# Altium schematic sheet DE-270124.SchDoc: RELAY BOARD
size A4; Author: eldar6776@hotmail.com; DrawnBy: Eldar Dedić; Organization: JUBERA d.o.o.; Address1: Braće Mulić 81; Address2: 71000 Sarajevo; Address3: Federacija BiH; Address4: Bosna i Hercegovina; DocumentNumber: 1; Revision: 001; SheetNumber: 1; SheetTotal: 1; ProjectName: DE'270124
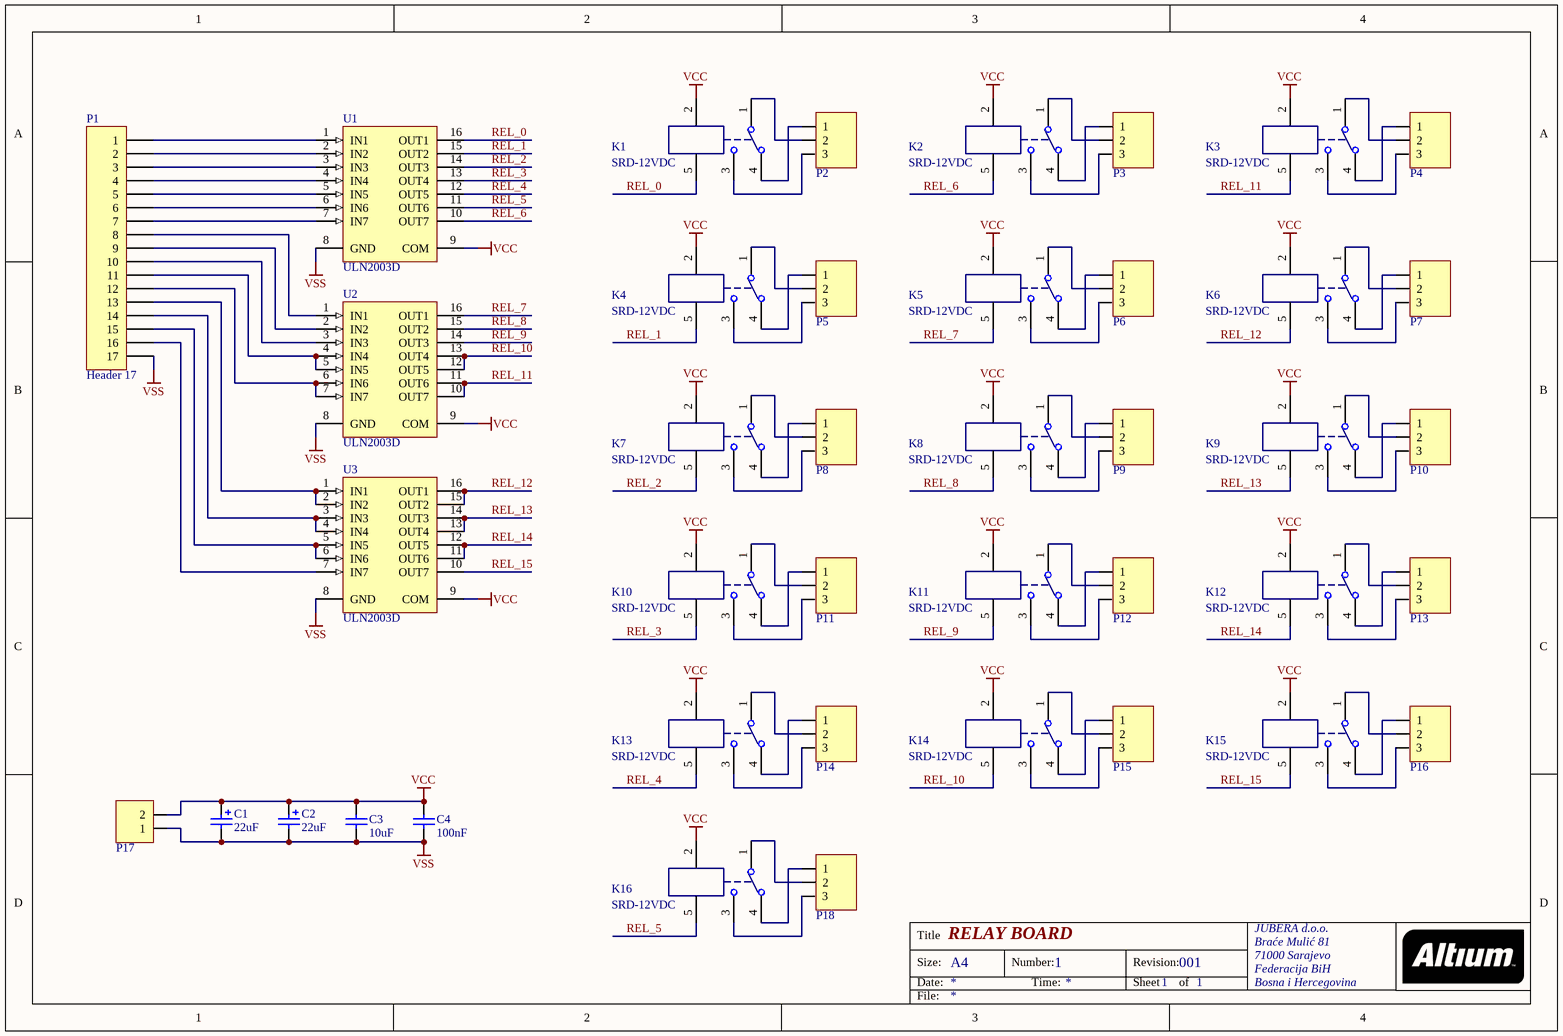
[diagram p0: DE-270124.SchDoc]

## Parts
C1  22uF  [CAPPR2-5X11]
C2  22uF  [CAPPR2-5X11]
C3  10uF  [0805]
C4  100nF  [0603]
K1  SRD-12VDC  [SRD-12VDC-SL-O]
K2  SRD-12VDC  [SRD-12VDC-SL-O]
K3  SRD-12VDC  [SRD-12VDC-SL-O]
K4  SRD-12VDC  [SRD-12VDC-SL-O]
K5  SRD-12VDC  [SRD-12VDC-SL-O]
K6  SRD-12VDC  [SRD-12VDC-SL-O]
K7  SRD-12VDC  [SRD-12VDC-SL-O]
K8  SRD-12VDC  [SRD-12VDC-SL-O]
K9  SRD-12VDC  [SRD-12VDC-SL-O]
K10  SRD-12VDC  [SRD-12VDC-SL-O]
K11  SRD-12VDC  [SRD-12VDC-SL-O]
K12  SRD-12VDC  [SRD-12VDC-SL-O]
K13  SRD-12VDC  [SRD-12VDC-SL-O]
K14  SRD-12VDC  [SRD-12VDC-SL-O]
K15  SRD-12VDC  [SRD-12VDC-SL-O]
K16  SRD-12VDC  [SRD-12VDC-SL-O]
P1  Header 17  [HDR1X17]
P2  TERMINAL BLOK 3  [TERMINAL BLOK 3]  (value not drawn)
P3  TERMINAL BLOK 3  [TERMINAL BLOK 3]  (value not drawn)
P4  TERMINAL BLOK 3  [TERMINAL BLOK 3]  (value not drawn)
P5  TERMINAL BLOK 3  [TERMINAL BLOK 3]  (value not drawn)
P6  TERMINAL BLOK 3  [TERMINAL BLOK 3]  (value not drawn)
P7  TERMINAL BLOK 3  [TERMINAL BLOK 3]  (value not drawn)
P8  TERMINAL BLOK 3  [TERMINAL BLOK 3]  (value not drawn)
P9  TERMINAL BLOK 3  [TERMINAL BLOK 3]  (value not drawn)
P10  TERMINAL BLOK 3  [TERMINAL BLOK 3]  (value not drawn)
P11  TERMINAL BLOK 3  [TERMINAL BLOK 3]  (value not drawn)
P12  TERMINAL BLOK 3  [TERMINAL BLOK 3]  (value not drawn)
P13  TERMINAL BLOK 3  [TERMINAL BLOK 3]  (value not drawn)
P14  TERMINAL BLOK 3  [TERMINAL BLOK 3]  (value not drawn)
P15  TERMINAL BLOK 3  [TERMINAL BLOK 3]  (value not drawn)
P16  TERMINAL BLOK 3  [TERMINAL BLOK 3]  (value not drawn)
P17  TERMINAL BLOK 2  [TERMINAL BLOK 2]  (value not drawn)
P18  TERMINAL BLOK 3  [TERMINAL BLOK 3]  (value not drawn)
U1  ULN2003D  [SO16_N]
U2  ULN2003D  [SO16_N]
U3  ULN2003D  [SO16_N]

## Nets
VCC: C1.1 C2.1 C3.2 C4.2 K1.2 K2.2 K3.2 K4.2 K5.2 K6.2 K7.2 K8.2 K9.2 K10.2 K11.2 K12.2 K13.2 K14.2 K15.2 K16.2 P17.2 U1.9(COM) U2.9(COM) U3.9(COM)
VSS: C1.2 C2.2 C3.1 C4.1 P1.17 P17.1 U1.8(GND) U2.8(GND) U3.8(GND)
REL_0: K1.5 U1.16(OUT1)
REL_1: K4.5 U1.15(OUT2)
REL_2: K7.5 U1.14(OUT3)
REL_3: K10.5 U1.13(OUT4)
REL_4: K13.5 U1.12(OUT5)
REL_5: K16.5 U1.11(OUT6)
REL_6: K2.5 U1.10(OUT7)
REL_7: K5.5 U2.16(OUT1)
REL_8: K8.5 U2.15(OUT2)
REL_9: K11.5 U2.14(OUT3)
REL_10: K14.5 U2.12(OUT5) U2.13(OUT4)
REL_11: K3.5 U2.10(OUT7) U2.11(OUT6)
REL_12: K6.5 U3.15(OUT2) U3.16(OUT1)
REL_13: K9.5 U3.13(OUT4) U3.14(OUT3)
REL_14: K12.5 U3.11(OUT6) U3.12(OUT5)
REL_15: K15.5 U3.10(OUT7)
NetK1_1: K1.1 P2.2
NetK1_3: K1.3 P2.3
NetK1_4: K1.4 P2.1
NetK2_1: K2.1 P3.2
NetK2_3: K2.3 P3.3
NetK2_4: K2.4 P3.1
NetK3_1: K3.1 P4.2
NetK3_3: K3.3 P4.3
NetK3_4: K3.4 P4.1
NetK4_1: K4.1 P5.2
NetK4_3: K4.3 P5.3
NetK4_4: K4.4 P5.1
NetK5_1: K5.1 P6.2
NetK5_3: K5.3 P6.3
NetK5_4: K5.4 P6.1
NetK6_1: K6.1 P7.2
NetK6_3: K6.3 P7.3
NetK6_4: K6.4 P7.1
NetK7_1: K7.1 P8.2
NetK7_3: K7.3 P8.3
NetK7_4: K7.4 P8.1
NetK8_1: K8.1 P9.2
NetK8_3: K8.3 P9.3
NetK8_4: K8.4 P9.1
NetK9_1: K9.1 P10.2
NetK9_3: K9.3 P10.3
NetK9_4: K9.4 P10.1
NetK10_1: K10.1 P11.2
NetK10_3: K10.3 P11.3
NetK10_4: K10.4 P11.1
NetK11_1: K11.1 P12.2
NetK11_3: K11.3 P12.3
NetK11_4: K11.4 P12.1
NetK12_1: K12.1 P13.2
NetK12_3: K12.3 P13.3
NetK12_4: K12.4 P13.1
NetK13_1: K13.1 P14.2
NetK13_3: K13.3 P14.3
NetK13_4: K13.4 P14.1
NetK14_1: K14.1 P15.2
NetK14_3: K14.3 P15.3
NetK14_4: K14.4 P15.1
NetK15_1: K15.1 P16.2
NetK15_3: K15.3 P16.3
NetK15_4: K15.4 P16.1
NetK16_1: K16.1 P18.2
NetK16_3: K16.3 P18.3
NetK16_4: K16.4 P18.1
NetP1_1: P1.1 U1.1(IN1)
NetP1_2: P1.2 U1.2(IN2)
NetP1_3: P1.3 U1.3(IN3)
NetP1_4: P1.4 U1.4(IN4)
NetP1_5: P1.5 U1.5(IN5)
NetP1_6: P1.6 U1.6(IN6)
NetP1_7: P1.7 U1.7(IN7)
NetP1_8: P1.8 U2.1(IN1)
NetP1_9: P1.9 U2.2(IN2)
NetP1_10: P1.10 U2.3(IN3)
NetP1_11: P1.11 U2.4(IN4) U2.5(IN5)
NetP1_12: P1.12 U2.6(IN6) U2.7(IN7)
NetP1_13: P1.13 U3.1(IN1) U3.2(IN2)
NetP1_14: P1.14 U3.3(IN3) U3.4(IN4)
NetP1_15: P1.15 U3.5(IN5) U3.6(IN6)
NetP1_16: P1.16 U3.7(IN7)

## Notes on the sheet
- Title
- Size:
- Date:
- A4
- Number:
- Time:
- Revision:
- Sheet
- of
- File:

## Library data of the parts
C1 C2 = EKA00AA247F00: Aluminum Electrolytic Capacitor, Radial Style with Long Leads: 47uF, 35V; Note: Refer to Manufacturer's Data Sheets for other lead formations; DrillSize: Nominal, Rounded To The Nearest 0.1mm; Published: 19-Mar-2004; DatasheetDocument: 20-Feb-2001; PackageReference: CAPPR2-5X11; Publisher: Altium Limited; ComponentLink1Description: Manufacturer Link; ComponentLink1URL: http://www.vishay.com/; ComponentLink2Description: Datasheet; ComponentLink2URL: http://www.vishay.com/docs/25014/eka.pdf; Value: 47uF
C3 = C0805: Ceramic Chip Capacitor - Standard; Note: Footprint corresponds to dimensions for bulk cassette packaging. This case size has tightened tolerances.; Published: 17-Jul-2002; LatestRevisionDate: 19-Mar-2004; LatestRevisionNote: Silkscreen size reduced.; DatasheetDocument: Mar-2001; PackageDocument: Mar-2001; PackageReference: 0805; Publisher: Altium Limited; Code_JEITA: 0805; Code_IPC: 2012[0805]; ComponentLink1Description: Manufacturer Link; ComponentLink1URL: http://www.kemet.com/; ComponentLink2Description: Datasheet; ComponentLink2URL: http://www.kemet.com/kemet/web/homepage/kechome.nsf/vapubfilesname/F3102TA.pdf/$file/F3102TA.pdf
C4 = C0603: Ceramic Chip Capacitor - Standard; Note: Footprint corresponds to dimensions for bulk cassette packaging. This case size has tightened tolerances.; Published: 17-Jul-2002; LatestRevisionDate: 19-Mar-2004; LatestRevisionNote: Silkscreen size reduced.; DatasheetDocument: Mar-2001; PackageDocument: Mar-2001; PackageReference: 0603; Publisher: Altium Limited; Code_JEITA: 0603; Code_IPC: 1608 [0603]; ComponentLink1Description: Manufacturer Link; ComponentLink1URL: http://www.kemet.com/; ComponentLink2Description: Datasheet; ComponentLink2URL: http://www.kemet.com/kemet/web/homepage/kechome.nsf/vapubfilesname/F3102TA.pdf/$file/F3102TA.pdf
K1-K16 = SRD-12VDC-SL-O: SPDT PCB relay 12Vc coil
P1 = Header 17: Header, 17-Pin; LatestRevisionDate: 17-Jul-2002; LatestRevisionNote: Re-released for DXP Platform.; Publisher: Altium Limited
P2-P16 P18 = TERMINAL BLOK 3: 3 pinski terminal blok konektor
P17 = TERMINAL BLOK 2: 2 pinski terminal blok
U1-U3 = ULN2003D: Seven Darlington Array; Published: 8-Jun-2000; LatestRevisionDate: 13-Apr-2006; LatestRevisionNote: IPC-7351 Footprint Added.; DatasheetVersion: Sep-1998; PackageVersion: May-1998; PackageReference: SO16; Publisher: Altium Limited; PackageDescription: 16-Pin Small Outline Integrated Circuit 1.27 mm Pitch; Code_IPC: SOIC127P600-16; ComponentLink1Description: Manufacturer Link; ComponentLink1URL: http://www.st.com/; ComponentLink2Description: Datasheet; ComponentLink2URL: http://www.st.com/stonline/products/literature/ds/5279/uln2001.pdf